# Altium schematic sheet I2C_Shield.SchDoc: SERDAR
size 420 x 297 mm; SheetNumber: 1; SheetTotal: 1
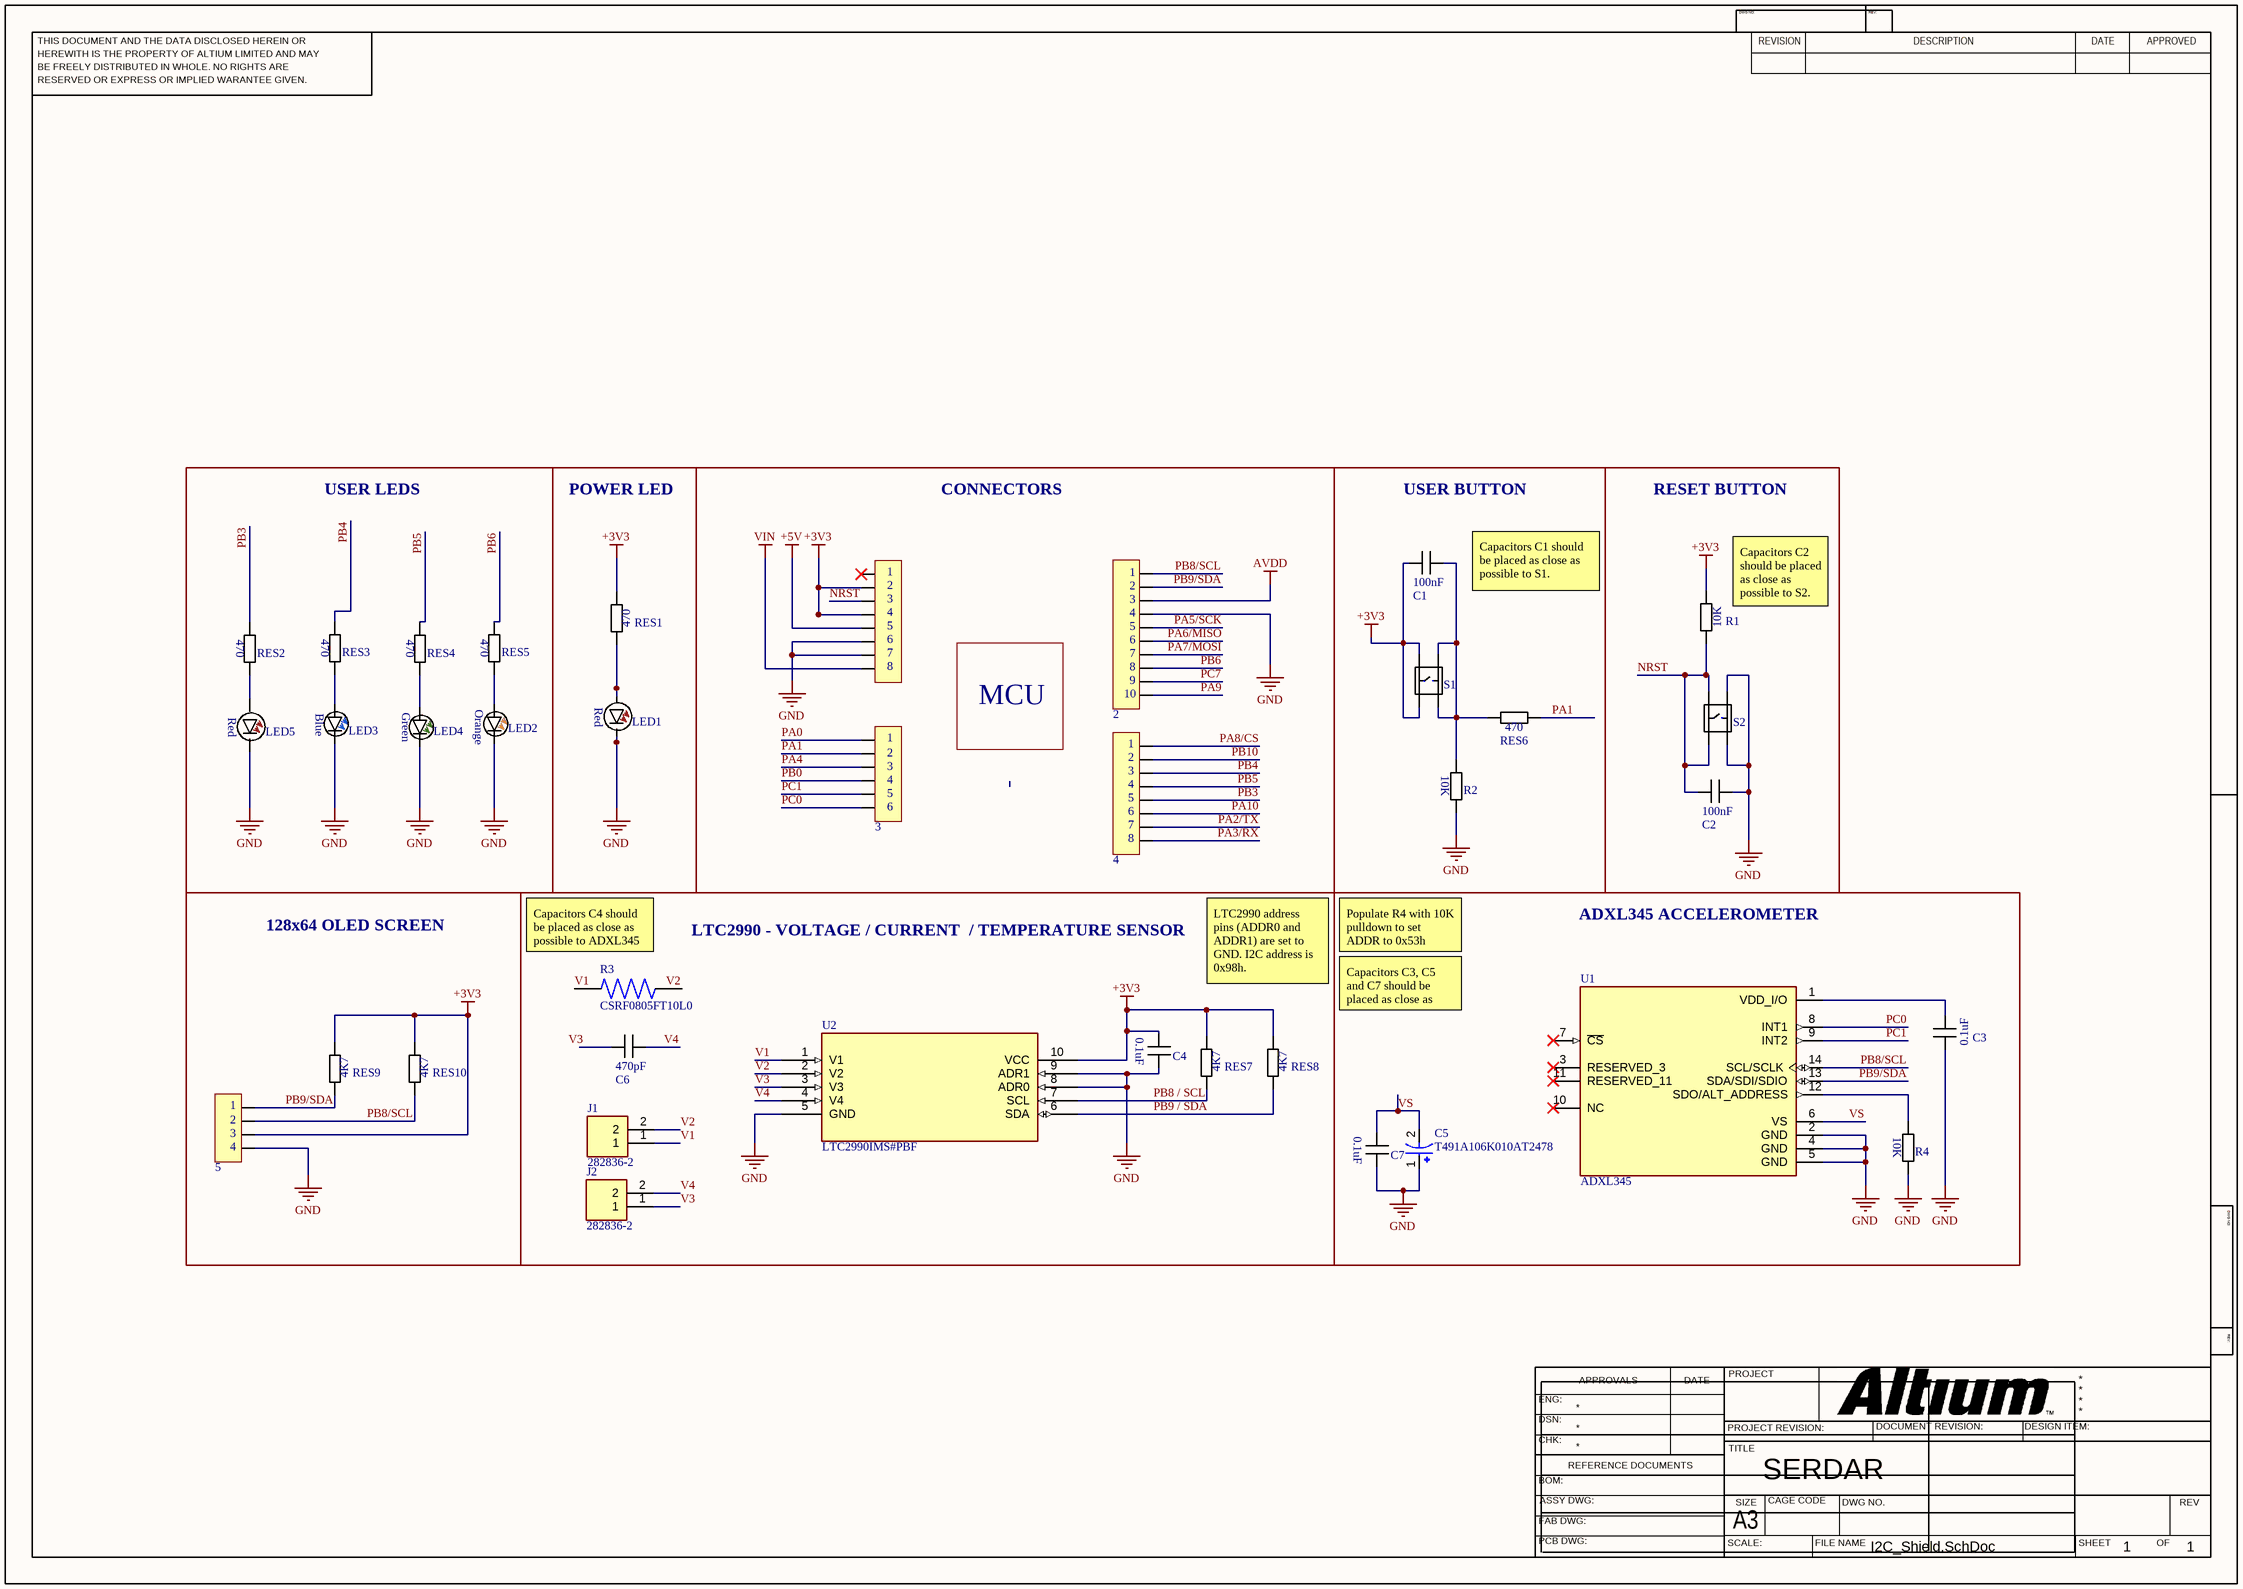
[diagram p0: I2C_Shield.SchDoc]

## Parts
2  10X1_Header_2.54  [10X1_HEADER]  (value not drawn)
3  6x1_Header_2.54  [6X1_HEADER]  (value not drawn)
4  8x1_Header_2.54  [8x1_HEADER]  (value not drawn)
5  4x1_Header_2.54  [4X1_HEADER]  (value not drawn)
*  Title  (value not drawn)  (graphical)
?  8x1_Header_2.54  [8x1_HEADER]  (value not drawn)
C1  CAP_0805_100nF*  [CAP_0805]  (value not drawn)
C2  CAP_0805_100nF*  [CAP_0805]  (value not drawn)
C3  CAP_0805_0.1uF  [CAP_0805]  (value not drawn)
C4  CAP_0805_0.1uF  [CAP_0805]  (value not drawn)
C5  T491A106K010AT2478  [CAPMP3216X180N]
C6  CAP_0805_470pF  [CAP_0805]  (value not drawn)
C7  CAP_0805_0.1uF  [CAP_0805]  (value not drawn)
J1  282836-2  [TE_282836-2]
J2  282836-2  [TE_282836-2]
LED1  LED_0805_Red  [LED_0805]  (value not drawn)
LED2  LED_0805_Orange  [LED_0805]  (value not drawn)
LED3  LED_0805_Blue  [LED_0805]  (value not drawn)
LED4  LED_0805_Green  [LED_0805]  (value not drawn)
LED5  LED_0805_Red  [LED_0805]  (value not drawn)
R1  RES_0805_10K  [RES_0805]  (value not drawn)
R2  RES_0805_10K  [RES_0805]  (value not drawn)
R3  CSRF0805FT10L0  [RESC2113X85N]
R4  RES_0805_10K  [RES_0805]  (value not drawn)
RES1  RES_0805_470  [RES_0805]  (value not drawn)
RES2  RES_0805_470  [RES_0805]  (value not drawn)
RES3  RES_0805_470  [RES_0805]  (value not drawn)
RES4  RES_0805_470  [RES_0805]  (value not drawn)
RES5  RES_0805_470  [RES_0805]  (value not drawn)
RES6  RES_0805_470  [RES_0805]  (value not drawn)
RES7  RES_0805_4K7  [RES_0805]  (value not drawn)
RES8  RES_0805_4K7  [RES_0805]  (value not drawn)
RES9  RES_0805_4K7  [RES_0805]  (value not drawn)
RES10  RES_0805_4K7  [RES_0805]  (value not drawn)
S1  6MM_Button  [BUTTON]  (value not drawn)
S2  6MM_Button  [BUTTON]  (value not drawn)
U1  ADXL345  [PQFN80P500X300X100-14N]
U2  LTC2990IMS#PBF  [MSOP-10_MS]

## Blocks framed on the sheet
USER LEDS: LED2-LED5 RES2-RES5
POWER LED: LED1 RES1
MCU: 2-4 ?
USER BUTTON: C1 R2 RES6 S1
RESET BUTTON: C2 R1 S2
128x64 OLED SCREEN: 5 RES9 RES10
LTC2990 - VOLTAGE / CURRENT  / TEMPERATURE SENSOR: C4 C6 J1 J2 R3 RES7 RES8 U2
ADXL345 ACCELEROMETER: C3 C5 C7 R4 U1

## Nets
+3V3: 5.03 ?.02 ?.04 C1.1 C4.1 R1.2 RES1.2 RES7.2 RES8.2 RES9.2 RES10.2 S1.1 S1.3 U2.10(VCC)
+5V: ?.05
AVDD: 2.03
GND: 2.04 5.04 ?.06 ?.07 C2.2 C3.1 C4.2 C5.1 C7.2 LED1.C LED2.C LED3.C LED4.C LED5.C R2.2 R4.2 S2.2 S2.4 U1.2(GND) U1.4(GND) U1.5(GND) U2.5(GND) U2.8(ADR0) U2.9(ADR1)
VIN: ?.08
NRST: ?.03 C2.1 R1.1 S2.1 S2.3
PA0: 3.01
PA1: 3.02 RES6.2
PA2/TX: 4.07
PA3/RX: 4.08
PA4: 3.03
PA5/SCK: 2.05
PA6/MISO: 2.06
PA7/MOSI: 2.07
PA8/CS: 4.01
PA9: 2.10
PA10: 4.06
PB0: 3.04
PB3: 4.05 RES2.1
PB4: 4.03 RES3.1
PB5: 4.04 RES4.1
PB6: 2.08 RES5.1
PB8 / SCL: RES7.1 U2.7(SCL)
PB8/SCL: 2.01 5.02 RES10.1 U1.14(SCL/SCLK)
PB9 / SDA: RES8.1 U2.6(SDA)
PB9/SDA: 2.02 5.01 RES9.1 U1.13(SDA/SDI/SDIO)
PB10: 4.02
PC0: 3.06 U1.8(INT1)
PC1: 3.05 U1.9(INT2)
PC7: 2.09
V1: J1.1 R3.1 U2.1(V1)
V2: J1.2 R3.2 U2.2(V2)
V3: C6.1 J2.1 U2.3(V3)
V4: C6.2 J2.2 U2.4(V4)
VS: C5.2 C7.1 U1.6(VS)
NetC1_2: C1.2 R2.1 RES6.1 S1.2 S1.4
NetC3_2: C3.2 U1.1(VDD_I/O)
NetLED1_A: LED1.A RES1.1
NetLED2_A: LED2.A RES5.2
NetLED3_A: LED3.A RES3.2
NetLED4_A: LED4.A RES4.2
NetLED5_A: LED5.A RES2.2
NetR4_1: R4.1 U1.12(SDO/ALT_ADDRESS)

Not connected (* = marked no-connect by the designer): ? 01*; U1 3(RESERVED_3)* 7(~{CS})* 10(NC)* 11(RESERVED_11)*

## Notes on the sheet
- CONNECTORS
- (near C1) Capacitors C1 should be placed as close as possible to S1.
- (near R1) Capacitors C2 should be placed as close as possible to S2.
- (near R3) Capacitors C4 should be placed as close as possible to ADXL345
- LTC2990 address pins (ADDR0 and ADDR1) are set to GND. I2C address is 0x98h.
- Populate R4 with 10K pulldown to set ADDR to 0x53h
- Capacitors C3, C5 and C7 should be placed as close as possible to ADXL345
- THIS DOCUMENT AND THE DATA DISCLOSED HEREIN OR
- HEREWITH IS THE PROPERTY OF ALTIUM LIMITED AND MAY
- DWG NO:
- REVISION
- REV:
- DESCRIPTION
- DATE
- APPROVED
- BE FREELY DISTRIBUTED IN WHOLE. NO RIGHTS ARE
- RESERVED OR EXPRESS OR IMPLIED WARANTEE GIVEN.
- ENG:
- APPROVALS
- PROJECT
- DSN:
- CHK:
- REFERENCE DOCUMENTS
- PROJECT REVISION:
- TITLE
- DOCUMENT REVISION:
- DESIGN ITEM:
- BOM:
- FAB DWG:
- PCB DWG:
- ASSY DWG:
- SCALE:
- A3
- SIZE
- CAGE CODE
- FILE NAME
- DWG NO.
- SHEET
- OF
- REV
- (in symbol 4x1_Header_2.54) 1; 2; 3; 4
- (in symbol 6x1_Header_2.54) 1; 2; 4; 5; 6
- (in symbol 8x1_Header_2.54) 1; 2; 3; 5; 6; 7; 8; 4
- (in symbol 10X1_Header_2.54) 1; 3; 4; 5; 6; 7; 8; 9
- (in symbol CAP_0805_0.1uF) 0.1uF
- (in symbol CAP_0805_100nF) 100nF
- (in symbol CAP_0805_470pF) 470pF
- (in symbol LED_0805_Blue) Blue
- (in symbol LED_0805_Green) Green
- (in symbol LED_0805_Orange) Orange
- (in symbol LED_0805_Red) Red
- (in symbol RES_0805_4K7) 4K7
- (in symbol RES_0805_10K) 10K
- (in symbol RES_0805_470) 470

## Library data of the parts
C1 C2 = CAP_0805_100nF
C5 = T491A106K010AT2478: 10 ÂµF Molded Tantalum Capacitors 10 V 1206 (3216 Metric) 3.8Ohm; MF: KEMET; Price: None; Value: *; MP: T491A106K010AT2478; Package: SMD-2 KEMET; Purchase-URL: https://pricing.snapeda.com/search/part/T491A106K010AT2478/?ref=eda; SnapEDA_Link: https://www.snapeda.com/parts/T491A106K010AT2478/KEMET/view-part/?ref=snap; Check_prices: https://www.snapeda.com/parts/T491A106K010AT2478/KEMET/view-part/?ref=eda; Availability: In Stock
J1 J2 = 282836-2: Connector, Terminal Block; Wire Receptacle; 2 Pos.; 16-30 AWG; 0.197 in. CL; Sid; MF: TE Connectivity; Purchase-URL: https://pricing.snapeda.com/search/part/282836-2/?ref=eda; Value: *; MP: 282836-2; Package: None; Check_prices: https://www.snapeda.com/parts/282836-2/TE+Connectivity+AMP+Connectors/view-part/?ref=eda; Price: None; SnapEDA_Link: https://www.snapeda.com/parts/282836-2/TE+Connectivity+AMP+Connectors/view-part/?ref=snap; Availability: In Stock
R1 R2 R4 = RES_0805_10K: 0805 10K Ohms 5% 1/8W 100PPM SMT
R3 = CSRF0805FT10L0: 10 mOhms Â±1% 0.5W, 1/2W Chip Resistor 0805 (2012 Metric) Automotive AEC-Q200, Current Sense, Moisture Resistant Metal Foil; MF: Stackpole Electronics; SnapEDA_Link: https://www.snapeda.com/parts/CSRF0805FT10L0/Stackpole+Electronics/view-part/?ref=snap; Package: 0805 Stackpole Electronics; Value: *; MP: CSRF0805FT10L0; Check_prices: https://www.snapeda.com/parts/CSRF0805FT10L0/Stackpole+Electronics/view-part/?ref=eda
U1 = ADXL345: Accelerometer X, Y, Z Axis ±2g, 4g, 8g, 16g 0.05Hz ~ 1.6kHz 14-LGA (3x5); MF: Analog Devices, Inc.; SnapEDA_Link: https://www.snapeda.com/parts/ADXL345/Analog+Devices/view-part/?ref=snap; Package: LGA -14 Analog Devices; Value: *; MP: ADXL345; Check_prices: https://www.snapeda.com/parts/ADXL345/Analog+Devices/view-part/?ref=eda
U2 = LTC2990IMS#PBF: Quad I2C Voltage, Current and Temperature Monitor; MF: Analog Devices; Package: MSOP-10 Analog Devices; Price: None; Check_prices: https://www.snapeda.com/parts/LTC2990IMS%23PBF/Analog+Devices/view-part/?ref=eda; Value: *; SnapEDA_Link: https://www.snapeda.com/parts/LTC2990IMS%23PBF/Analog+Devices/view-part/?ref=snap; MP: LTC2990IMS#PBF; Availability: In Stock; Purchase-URL: https://pricing.snapeda.com/search?q=LTC2990IMS#PBF&ref=eda